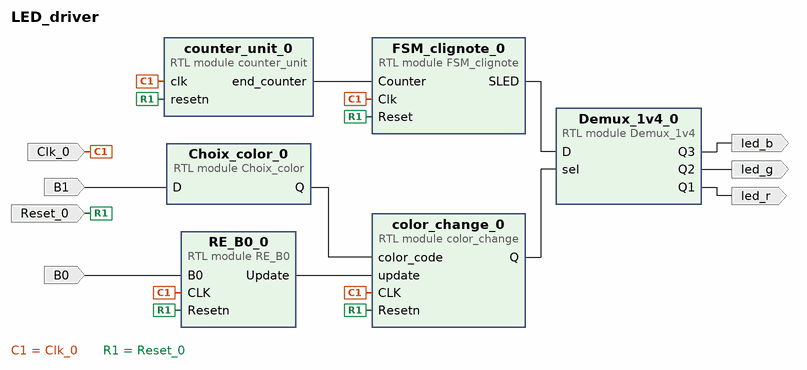
[diagram p0: block diagram of the top level]
# Vivado block design LED_driver, xc7z010clg400-1, Vivado 2024.1
create_bd_design LED_driver

create_bd_port -dir I -type clk Clk_0
create_bd_port -dir I -type rst Reset_0
create_bd_port -dir O led_r
create_bd_port -dir O led_g
create_bd_port -dir O led_b
create_bd_port -dir I B0
create_bd_port -dir I B1

create_bd_cell -type module -reference counter_unit counter_unit_0
set_property -dict {CONFIG.max 100000000} [get_bd_cells counter_unit_0]
create_bd_cell -type module -reference FSM_clignote FSM_clignote_0
create_bd_cell -type module -reference Demux_1v4 Demux_1v4_0
create_bd_cell -type module -reference Choix_color Choix_color_0
create_bd_cell -type module -reference RE_B0 RE_B0_0
create_bd_cell -type module -reference color_change color_change_0

# ---- connections ----

connect_bd_net -net B0_1 [get_bd_ports B0] [get_bd_pins RE_B0_0/B0]
connect_bd_net [get_bd_pins Choix_color_0/Q] [get_bd_pins color_change_0/color_code]
connect_bd_net -net Clk_0_1 [get_bd_ports Clk_0] \
  [get_bd_pins counter_unit_0/clk] [get_bd_pins FSM_clignote_0/Clk] [get_bd_pins RE_B0_0/CLK] \
  [get_bd_pins color_change_0/CLK]
connect_bd_net -net D_0_2 [get_bd_ports B1] [get_bd_pins Choix_color_0/D]
connect_bd_net [get_bd_pins Demux_1v4_0/Q1] [get_bd_ports led_r]
connect_bd_net [get_bd_pins Demux_1v4_0/Q2] [get_bd_ports led_g]
connect_bd_net [get_bd_pins Demux_1v4_0/Q3] [get_bd_ports led_b]
connect_bd_net [get_bd_pins FSM_clignote_0/SLED] [get_bd_pins Demux_1v4_0/D]
connect_bd_net [get_bd_pins RE_B0_0/Update] [get_bd_pins color_change_0/update]
connect_bd_net -net Reset_0_1 [get_bd_ports Reset_0] \
  [get_bd_pins counter_unit_0/resetn] [get_bd_pins FSM_clignote_0/Reset] [get_bd_pins RE_B0_0/Resetn] \
  [get_bd_pins color_change_0/Resetn]
connect_bd_net [get_bd_pins color_change_0/Q] [get_bd_pins Demux_1v4_0/sel]
connect_bd_net [get_bd_pins counter_unit_0/end_counter] [get_bd_pins FSM_clignote_0/Counter]

validate_bd_design
save_bd_design
